# EasyEDA Pro project tmkibot_1.eprj

# Schematic Schematic1
Board Name: Board1; Create Date: 2025-09-20; Page Name: P1; Project Name: tmkibot_1; Schematic Name: Schematic1; Update Date: 2025-09-20; Company: EasyEDA.com; Page Size: A4; Version: V1.0
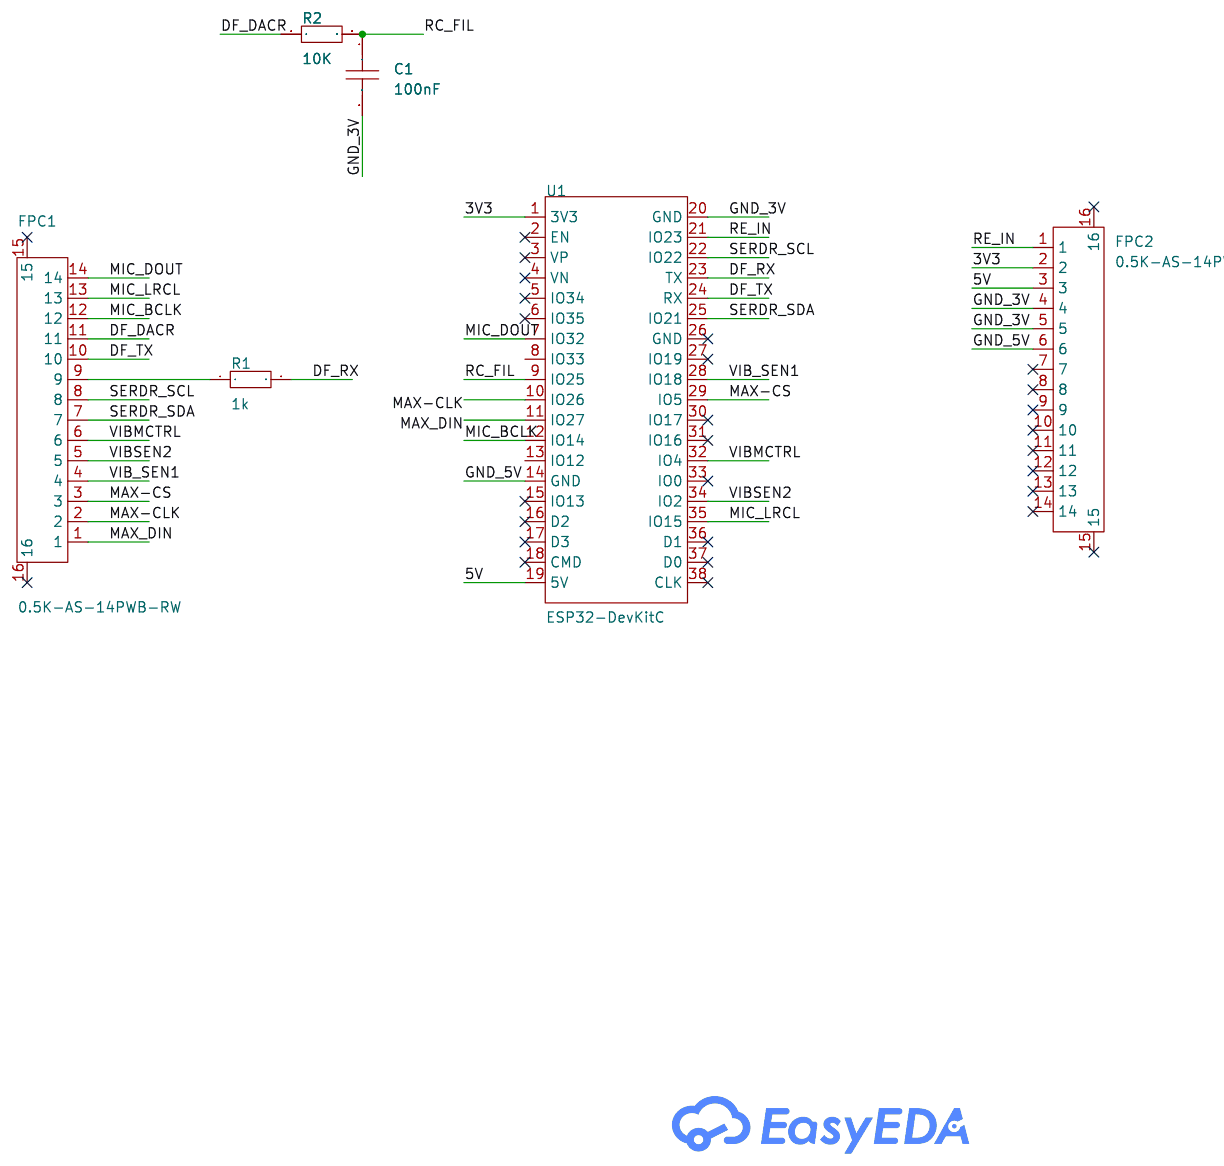
[diagram p0: schematic sheet]

## Parts
C1  100nF  [C0603]
FPC1  0.5K-AS-14PWB-RW  [FPC-SMD_14P-P0.50_0.5K-AS-14PWB-RW]
FPC2  0.5K-AS-14PWB-RW  [FPC-SMD_14P-P0.50_0.5K-AS-14PWB-RW]
R1  10K  [R0603]
R2  10K  [R0603]
U1  ESP32-DevKitC  [BULETM-SMD_ESP32-DEVKITC]

## Library data of the parts
C1 = CAP_0603: Supplier Footprint: 0603
FPC1 FPC2 = 0.5K-AS-14PWB-RW: LCSC Part Name: 间距:0.5mm P数:14P 抽屉式 上接触 厚度2.0mm 卷; Supplier Part: C51901206; Manufacturer: GUOCONN(国连); Supplier Footprint: SMD,P=0.5mm,卧贴; Datasheet: https://item.szlcsc.com/datasheet/0.5K-AS-14PWB-RW/54589519.html; Supplier: LCSC
R1 R2 = Res_0603: Supplier Footprint: 0603
U1 = ESP32-DevKitC: LCSC Part Name: 开发板; Supplier Part: C571180; Manufacturer: ESPRESSIF(乐鑫); JLCPCB Part Class: Extended Part; Datasheet: https://atta.szlcsc.com/upload/public/pdf/source/20200521/C529586_D6FCDAFCFF160B3EDDF7DF28D600699D.pdf; Supplier: LCSC

## Nets
3V3: FPC2.2 U1.1(3V3)
5V: FPC2.3 U1.19(5V)
GND_3V: C1.2 FPC2.4 FPC2.5 U1.20(GND)
GND_5V: FPC2.6 U1.14(GND)
DF_DACR: FPC1.11 R2.1
DF_RX: R1.2 U1.23(TX)
DF_TX: FPC1.10 U1.24(RX)
MAX-CLK: FPC1.2 U1.10(IO26)
MAX-CS: FPC1.3 U1.29(IO5)
MAX_DIN: FPC1.1 U1.11(IO27)
MIC_BCLK: FPC1.12 U1.12(IO14)
MIC_DOUT: FPC1.14 U1.7(IO32)
MIC_LRCL: FPC1.13 U1.35(IO15)
RC_FIL: C1.1 R2.2 U1.9(IO25)
RE_IN: FPC2.1 U1.21(IO23)
SERDR_SCL: FPC1.8 U1.22(IO22)
SERDR_SDA: FPC1.7 U1.25(IO21)
VIB_SEN1: FPC1.4 U1.28(IO18)
VIBMCTRL: FPC1.6 U1.32(IO4)
VIBSEN2: FPC1.5 U1.34(IO2)
$1N2309: FPC1.9 R1.1

Not connected (* = marked no-connect by the designer): FPC1 15* 16*; FPC2 7* 8* 9* 10* 11* 12* 13* 14* 15* 16*; U1 2(EN)* 3(VP)* 4(VN)* 5(IO34)* 6(IO35)* 8(IO33) 13(IO12) 15(IO13)* 16(D2)* 17(D3)* 18(CMD)* 26(GND)* 27(IO19)* 30(IO17)* 31(IO16)* 33(IO0)* 36(D1)* 37(D0)* 38(CLK)*

# Board PCB1
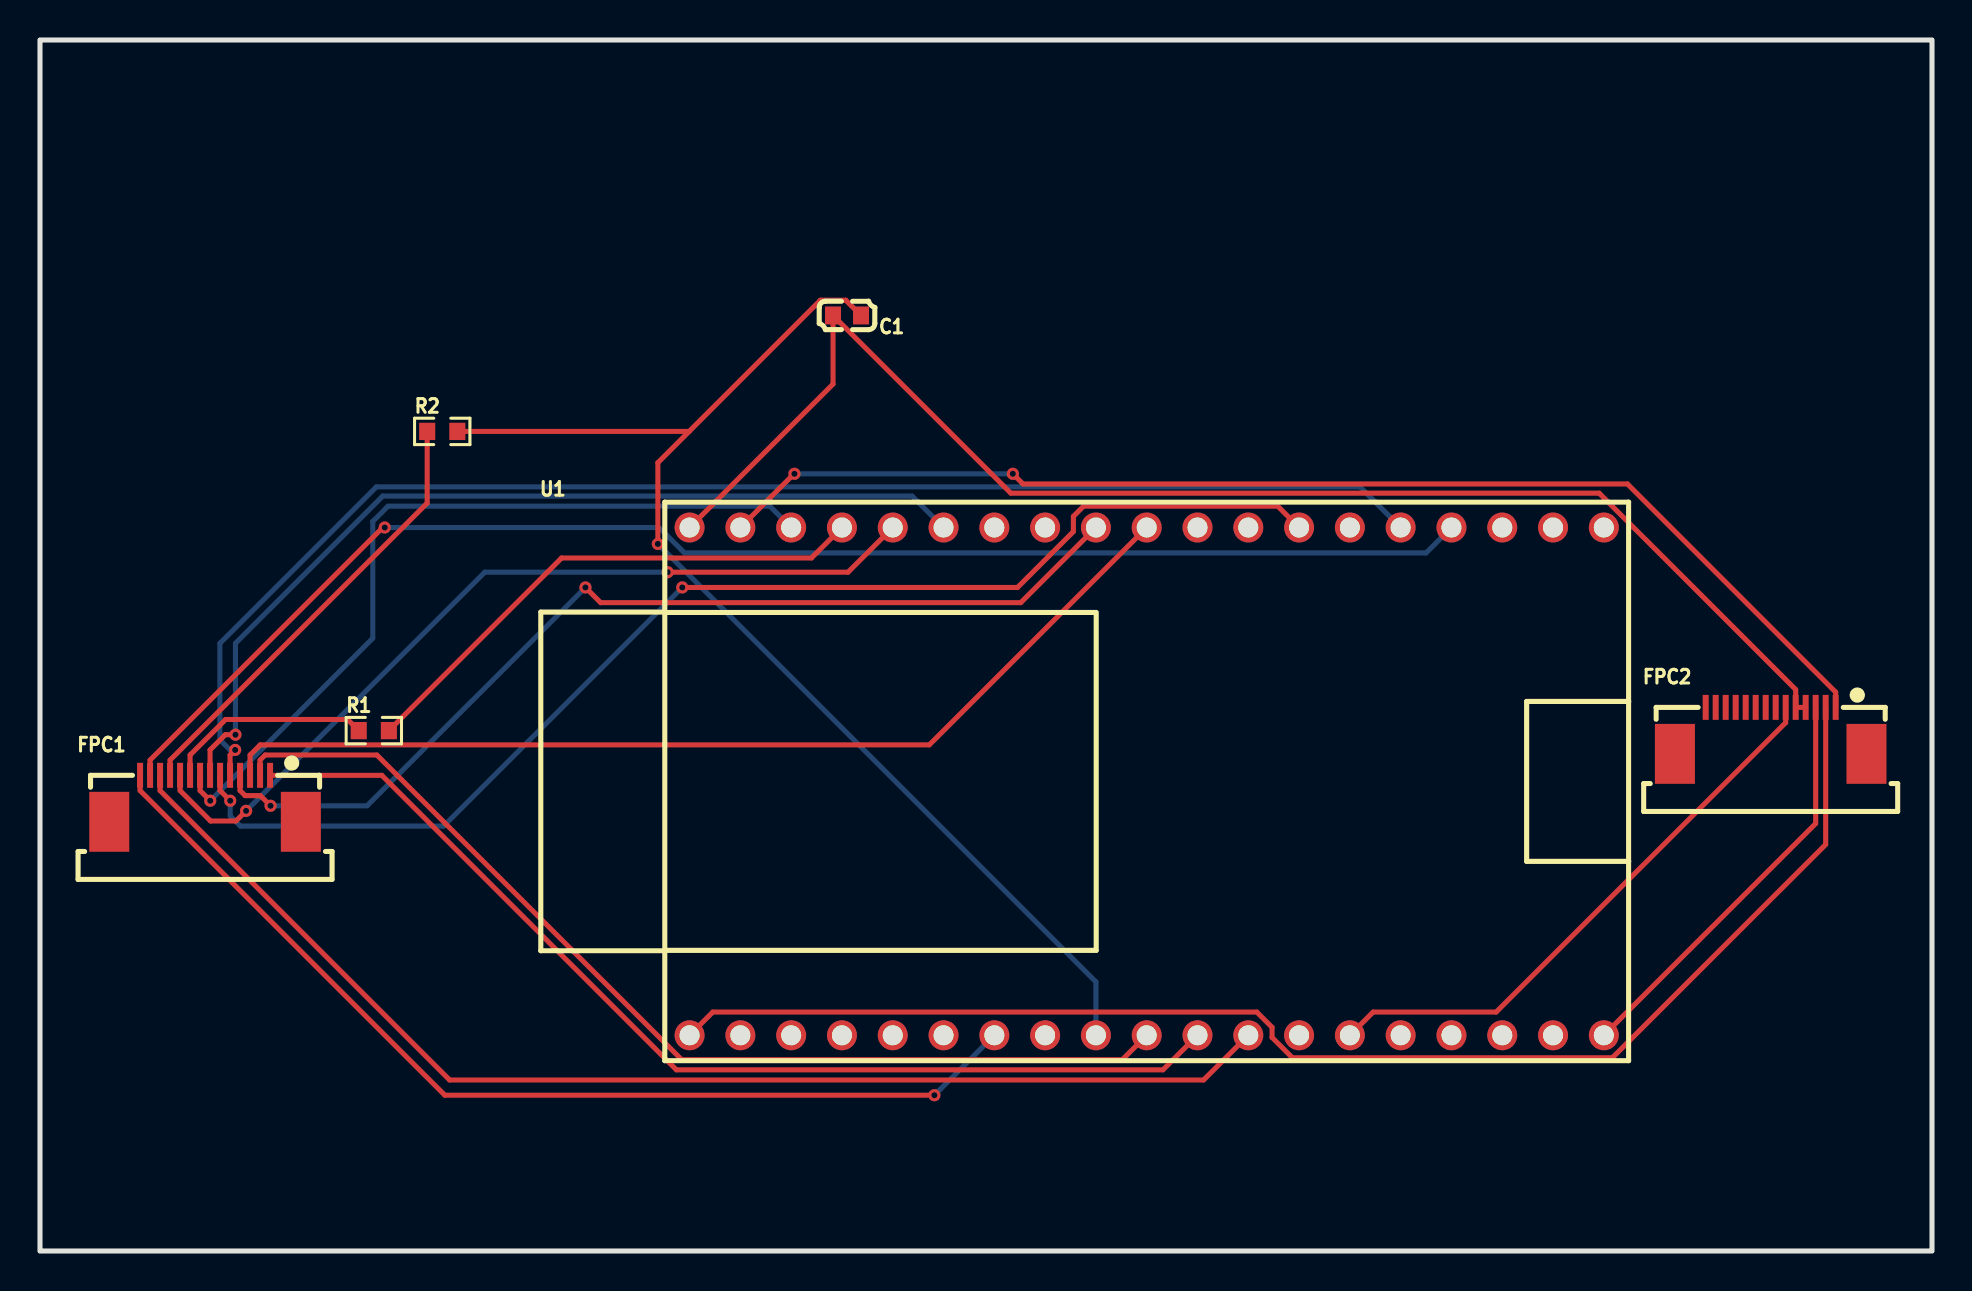
[diagram p1: board, top side]
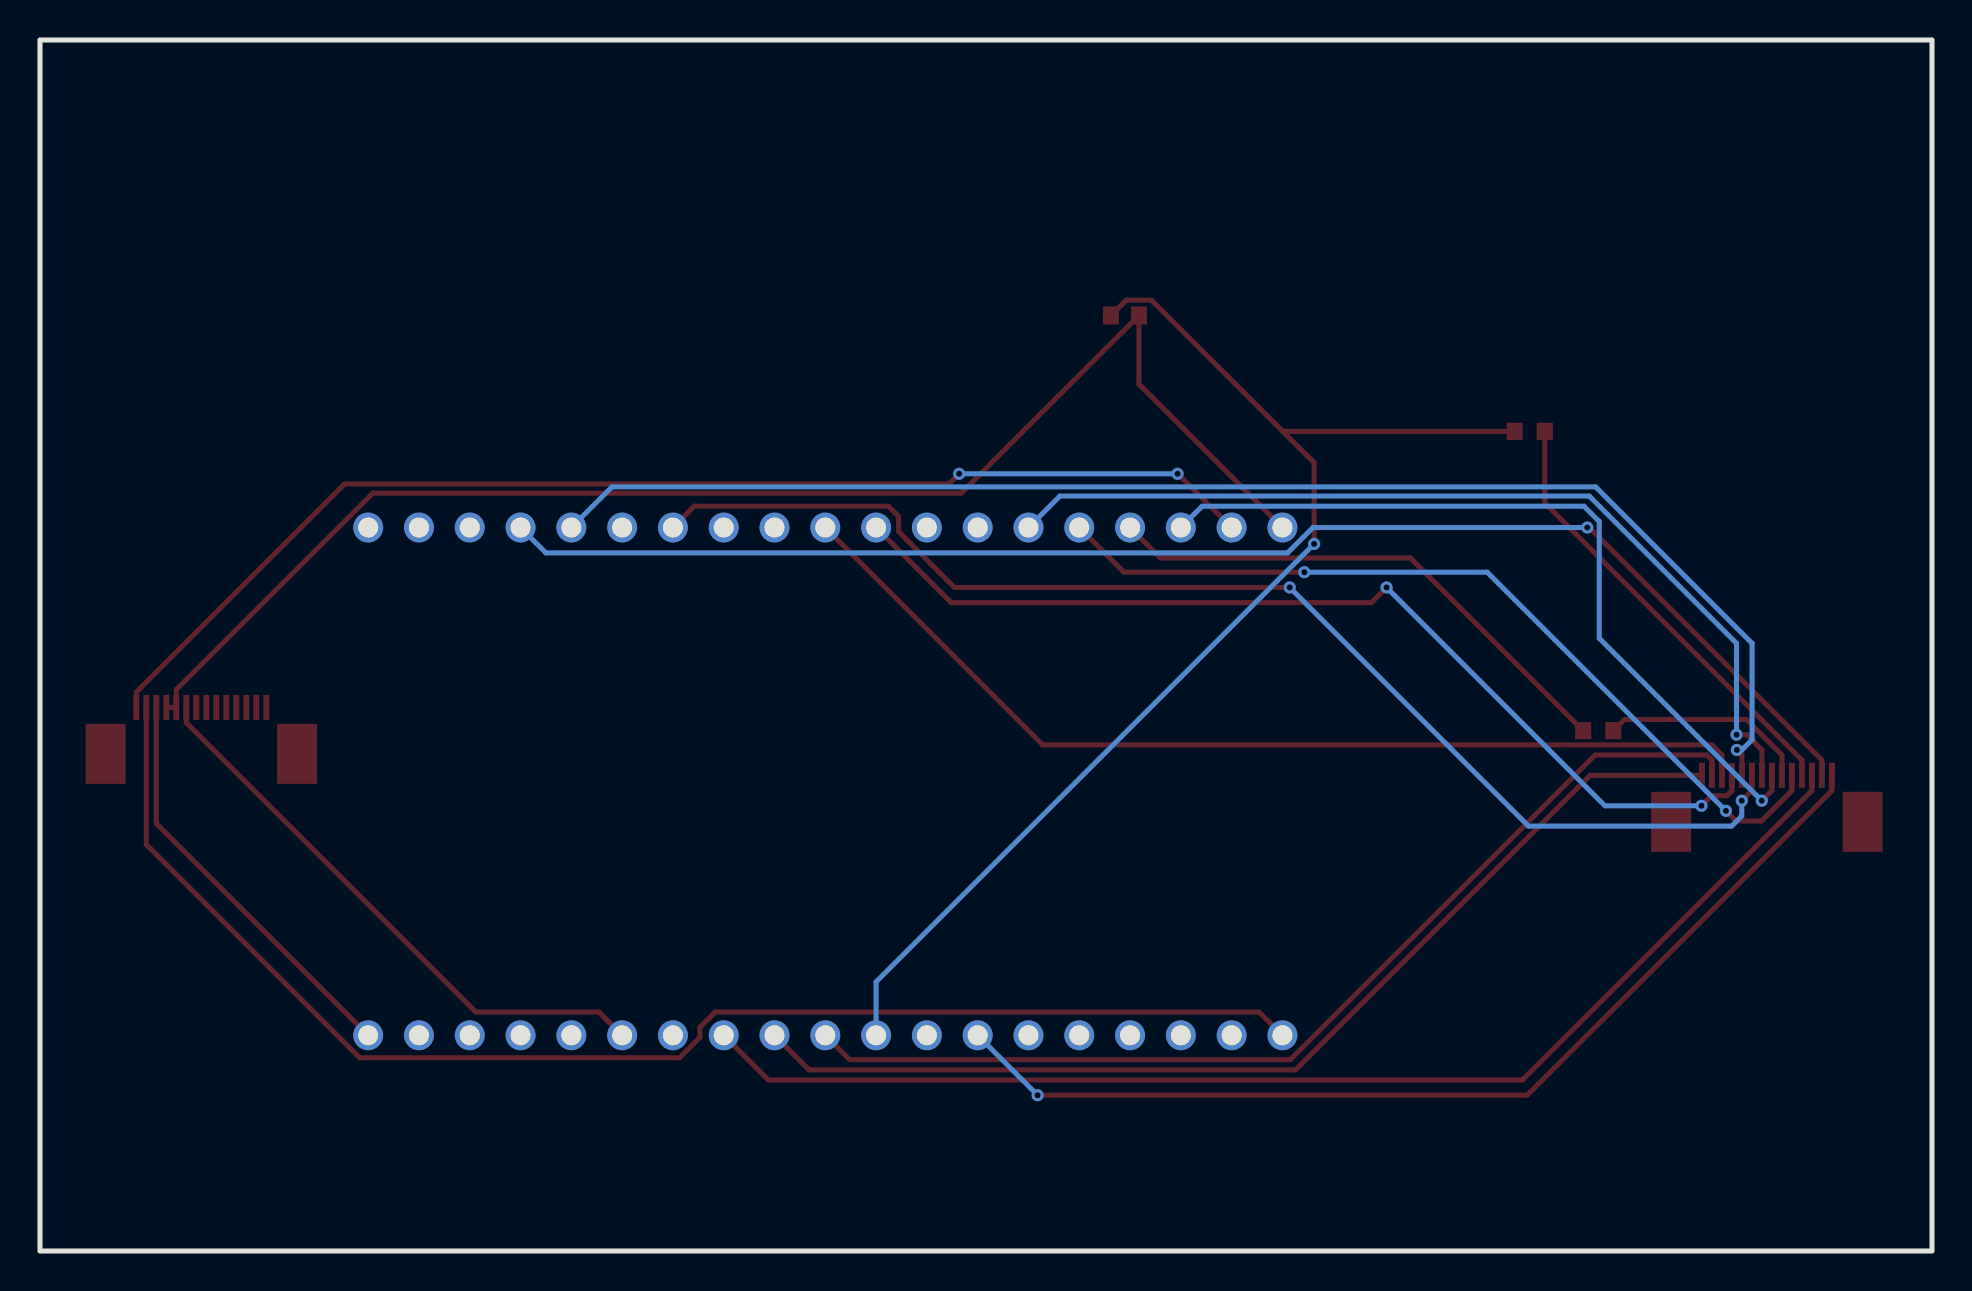
[diagram p2: board, bottom side, seen from below]

Outline 94.61 x 60.58 mm; copper layers: Top Layer, Bottom Layer. Coordinates in mm from the lower left corner of the outline.
Outline path: rectangle 0,60.58 94.61,0
Stack: Top Layer 0.035mm / Dielectric1 1.51mm FR4 er 4.5 / Bottom Layer 0.035mm

## Design rules (mm)
template: JLCPCB Capability(Two Layers Board)
spacing copperThickness1oz (default): track to track 0.102, other pairs 0.152 to 0.3
spacing copperThickness2oz: track to track 0.203, other pairs 0.152 to 0.3
track width copperThickness1oz (default): min 0.127, default 0.254, max 2.54
track width copperThickness2oz: min 0.203, default 0.254, max 2.54
differential pair differentialPair (default): width min 0.127, default 0.254, max 2.54; gap min 0.152, default 0.152
via viaSize (default): diameter min 0.5, default 0.61, max 10; hole min 0.3, default 0.305, max 6.3

## Placement (name value [footprint] x y rotation side)
C1  100nF  [C0603]  40.36 46.8 180 top
FPC1  0.5K-AS-14PWB-RW  [FPC-SMD_14P-P0.50_0.5K-AS-14PWB-RW]  8.26 22.63 0 top
FPC2  0.5K-AS-14PWB-RW  [FPC-SMD_14P-P0.50_0.5K-AS-14PWB-RW]  86.55 26.03 0 top
R1  10K  [R0603]  16.69 26.03 0 top
R2  10K  [R0603]  20.12 41 0 top
U1  ESP32-DevKitC  [BULETM-SMD_ESP32-DEVKITC]  55.34 23.49 0 top

## Footprints (pads in the part's own frame, mm; a bottom-side part is the same pattern mirrored in y, then rotated)
BULETM-SMD_ESP32-DEVKITC
  round 1.5 hole 1: 1(-22.86,-12.7) 2(-20.32,-12.7) 3(-17.78,-12.7) 4(-15.24,-12.7) 5(-12.7,-12.7) 6(-10.16,-12.7) 7(-7.62,-12.7) 8(-5.08,-12.7) 9(-2.54,-12.7) 10(0,-12.7) 11(2.54,-12.7) 12(5.08,-12.7) 13(7.62,-12.7) 14(10.16,-12.7) 15(12.7,-12.7) 16(15.24,-12.7) 17(17.78,-12.7) 18(20.32,-12.7) 19(22.86,-12.7) 20(-22.86,12.7) 21(-20.32,12.7) 22(-17.78,12.7) 23(-15.24,12.7) 24(-12.7,12.7) 25(-10.16,12.7) 26(-7.62,12.7) 27(-5.08,12.7) 28(-2.54,12.7) 29(0,12.7) 30(2.54,12.7) 31(5.08,12.7) 32(7.62,12.7) 33(10.16,12.7) 34(12.7,12.7) 35(15.24,12.7) 36(17.78,12.7) 37(20.32,12.7) 38(22.86,12.7)
C0603
  rect 0.8x0.9 smd: 1(-0.7,0) 2(0.7,0)
FPC-SMD_14P-P0.50_0.5K-AS-14PWB-RW
  rect 0.3x1.25 smd: 1(3.25,1.163) 2(2.75,1.163) 3(2.25,1.163) 4(1.75,1.163) 5(1.25,1.163) 6(0.75,1.163) 7(0.25,1.163) 8(-0.25,1.163) 9(-0.75,1.163) 10(-1.25,1.163) 11(-1.75,1.163) 12(-2.25,1.163) 13(-2.75,1.163) 14(-3.25,1.163)
  rect 2x3 smd: 15(-4.79,-1.163) 16(4.79,-1.163)
R0603
  rect 0.806x0.864 smd: 1(-0.753,0) 2(0.753,0)

## Nets
As in the schematic.

Pads without a net: FPC1 15 16; FPC2 7 8 9 10 11 12 13 14 15 16; U1 2 3 4 5 6 8 13 15 16 17 18 26 27 30 31 33 36 37 38

## Via types
v1: diameter 0.61, hole 0.305, Top Layer to Bottom Layer, 14 vias

## Routing (per net, layer and track width the routed paths; a pad name or vN(x,y) marks a point on that pad's centre or on a via; arc(x,y) is an arc through that point)
3V3: length 69.8
  Top Layer w0.254: U1.1 33.65,11.95 60.85,11.95 61.61,11.19 61.61,10.68 62.63,9.67 78.63,9.67 89.3,20.34 FPC2.2
5V: length 20.8
  Top Layer w0.254: U1.19 88.8,21.38 FPC2.3
GND_3V: length 70.9
  Top Layer w0.254: U1.20 39.66,43.36 C1.2 48.55,37.91 77.97,37.91 87.8,28.08 FPC2.5 FPC2.4
GND_5V: length 29
  Top Layer w0.254: U1.14 66.67,11.95 72.82,11.95 87.3,26.43 FPC2.6
DF_DACR: length 22.5
  Top Layer w0.254: R2.1 19.36,37.41 6.51,24.56 FPC1.11
DF_RX: length 26.9
  Top Layer w0.254: U1.23 38.58,34.67 26.08,34.67 R1.2
DF_TX: length 43.1
  Top Layer w0.254: v1(31.39,33.96) 40.41,33.96 U1.24 ; v1(10.31,22.02) 9.8,21.51 8.53,21.51 7.01,23.03 FPC1.10
  Bottom Layer w0.254: v1(31.39,33.96) 22.25,33.96 v1(10.31,22.02)
MAX-CLK: length 52
  Top Layer w0.254: U1.10 54.12,9.57 32.09,9.57 16.85,24.81 11.26,24.81 11.01,24.56 FPC1.2
MAX-CS: length 50.6
  Top Layer w0.254: FPC1.3 10.51,24.81 11.01,25.32 44.47,25.32 U1.29
MAX_DIN: length 53.2
  Top Layer w0.254: U1.11 56.16,9.06 31.83,9.06 17.09,23.8 FPC1.1
MIC_BCLK: length 62.1
  Top Layer w0.254: U1.12 58.19,8.56 20.48,8.56 6.01,23.03 FPC1.12
MIC_DOUT: length 51
  Top Layer w0.254: v1(44.73,7.79) 20.25,7.79 5.01,23.03 FPC1.14
  Bottom Layer w0.254: v1(44.73,7.79) U1.7
MIC_LRCL: length 71.7
  Top Layer w0.254: FPC1.13 5.51,24.56 17.18,36.23 17.2,36.23 v1(17.24,36.19)
  Bottom Layer w0.254: U1.35 69.31,34.92 32.23,34.92 30.95,36.19 v1(17.24,36.19)
RC_FIL: length 63.2
  Top Layer w0.254: C1.1 40.3,47.56 39.03,47.56 32.46,41 ; v1(30.9,35.37) 30.9,39.43 32.46,41 ; 32.46,41 R2.2
  Bottom Layer w0.254: U1.9 52.8,13.46 v1(30.9,35.37)
RE_IN: length 61.2
  Top Layer w0.254: FPC2.1 89.8,27.96 79.38,38.37 49.16,38.37 v1(48.65,38.88) ; v1(37.73,38.88) 37.71,38.88 U1.21
  Bottom Layer w0.254: v1(48.65,38.88) v1(37.73,38.88)
SERDR_SCL: length 40.5
  Top Layer w0.254: v1(8.51,22.53) 8.01,23.03 FPC1.8
  Bottom Layer w0.254: v1(8.51,22.53) 16.64,30.65 16.64,36.5 17.4,37.26 36.5,37.26 U1.22
SERDR_SDA: length 46.5
  Top Layer w0.254: FPC1.7 8.51,25.07 9.27,25.83 v1(9.78,25.83)
  Bottom Layer w0.254: U1.25 43.61,37.77 17.14,37.77 9.78,30.4 v1(9.78,25.83)
VIB_SEN1: length 50.3
  Top Layer w0.254: U1.28 49.04,32.43 28.04,32.43 v1(27.28,33.19) ; v1(11.53,22.27) 11.02,22.78 10.26,22.78 10.01,23.03 FPC1.4
  Bottom Layer w0.254: v1(27.28,33.19) 16.36,22.27 v1(11.53,22.27)
VIBMCTRL: length 63.4
  Top Layer w0.254: v1(9.51,22.53) 9.01,23.03 FPC1.6 ; U1.32 61.9,37.26 52.19,37.26 51.68,36.75 51.68,35.99 48.88,33.19 v1(32.12,33.19)
  Bottom Layer w0.254: v1(9.51,22.53) 9.51,21.76 10.02,21.26 20.18,21.26 v1(32.12,33.19)
VIBSEN2: length 70.3
  Top Layer w0.254: v1(9.76,25.07) 9.51,24.81 FPC1.5
  Bottom Layer w0.254: v1(9.76,25.07) 9.51,25.07 9,25.57 9,30.4 16.82,38.22 66.01,38.22 U1.34
$1N2309: length 10.4
  Top Layer w0.254: R1.1 15.38,26.59 9.28,26.59 7.51,24.81 FPC1.9
